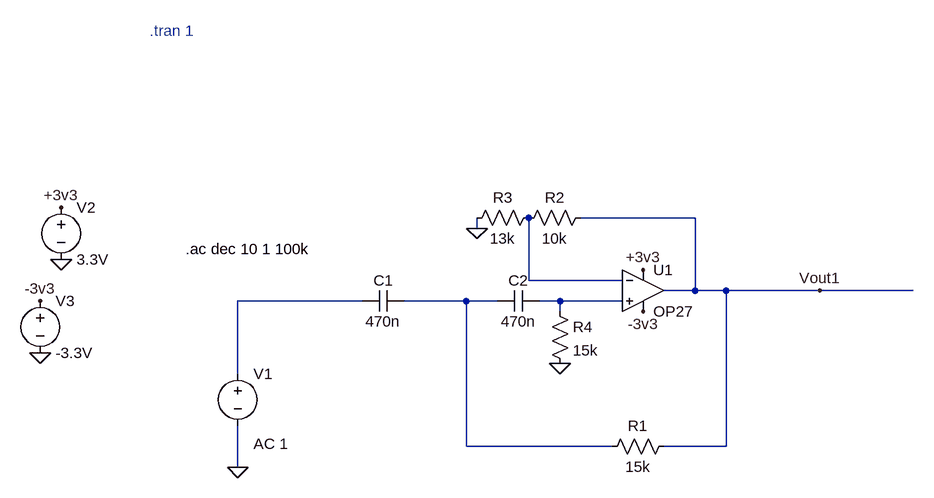
[diagram p0: schematic EMG_HPF_filter_test.asc]
EMG_HPF_filter_test.asc, the LTspice schematic file:
Version 4.1
SHEET 1 1700 712
WIRE 720 64 544 64
WIRE 384 80 384 64
WIRE 464 160 464 64
WIRE 608 160 464 160
WIRE 720 176 720 64
WIRE 720 176 672 176
WIRE 768 176 720 176
WIRE 912 176 768 176
WIRE 1056 176 912 176
WIRE 208 192 16 192
WIRE 368 192 272 192
WIRE 416 192 368 192
WIRE 512 192 480 192
WIRE 608 192 512 192
WIRE 512 208 512 192
WIRE 16 304 16 192
WIRE 368 416 368 192
WIRE 592 416 368 416
WIRE 768 416 768 176
WIRE 768 416 672 416
WIRE 16 448 16 384
FLAG -256 128 0
FLAG -288 272 0
FLAG -256 48 +3v3
FLAG -288 192 -3v3
FLAG 512 288 0
FLAG 640 208 -3v3
FLAG 640 144 +3v3
FLAG 16 448 0
FLAG 912 176 Vout1
FLAG 384 80 0
SYMBOL voltage -256 32 R0
WINDOW 123 0 0 Left 0
WINDOW 39 0 0 Left 0
SYMATTR InstName V2
SYMATTR Value 3.3V
SYMBOL voltage -288 176 R0
WINDOW 123 0 0 Left 0
WINDOW 39 0 0 Left 0
SYMATTR InstName V3
SYMATTR Value -3.3V
SYMBOL cap 480 176 R90
WINDOW 0 0 32 VBottom 2
WINDOW 3 32 32 VTop 2
SYMATTR InstName C2
SYMATTR Value 470n
SYMBOL res 496 192 R0
SYMATTR InstName R4
SYMATTR Value 15k
SYMBOL voltage 16 288 R0
WINDOW 123 24 124 Left 2
WINDOW 39 0 0 Left 0
SYMATTR Value2 AC 1
SYMATTR InstName V1
SYMATTR Value ""
SYMBOL res 688 400 R90
WINDOW 0 0 56 VBottom 2
WINDOW 3 32 56 VTop 2
SYMATTR InstName R1
SYMATTR Value 15k
SYMBOL cap 272 176 R90
WINDOW 0 0 32 VBottom 2
WINDOW 3 32 32 VTop 2
SYMATTR InstName C1
SYMATTR Value 470n
SYMBOL res 560 48 R90
WINDOW 0 0 56 VBottom 2
WINDOW 3 32 56 VTop 2
SYMATTR InstName R2
SYMATTR Value 10k
SYMBOL res 368 80 R270
WINDOW 0 32 56 VTop 2
WINDOW 3 0 56 VBottom 2
SYMATTR InstName R3
SYMATTR Value 13k
SYMBOL OpAmps\\OP27 640 112 R0
SYMATTR InstName U1
TEXT -120 -224 Left 2 ;.tran 1
TEXT -64 112 Left 2 !.ac dec 10 1 100k

The netlist it stands for:
* EMG_HPF_filter_test.asc
V2 +3v3 0 3.3V
V3 -3v3 0 -3.3V
C2 N004 N003 470n
R4 N004 0 15k
V1 N002 0 AC 1
R1 Vout1 N003 15k
C1 N003 N002 470n
R2 Vout1 N001 10k
R3 0 N001 13k
X§U1 N004 N001 +3v3 -3v3 Vout1 OP27  ; pins In+ In- V+ V- OUT
* .tran 1
.ac dec 10 1 100k
.lib ADI.lib
.backanno
.end